# Altium schematic sheet BDC.SchDoc
size C
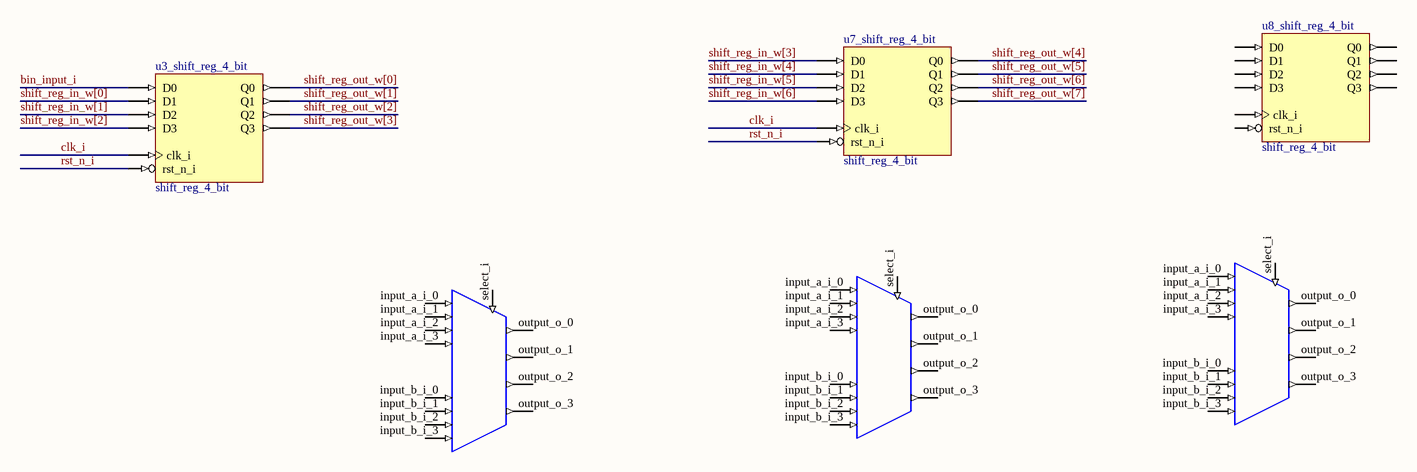
[diagram p0: BDC.SchDoc]

## Parts
(Parts that share a designator on the sheet are numbered #1, #2 ... from top to bottom, then left to right.)
u3_shift_reg_4_bit  shift_reg_4_bit
u7_shift_reg_4_bit  shift_reg_4_bit
u8_shift_reg_4_bit  shift_reg_4_bit
U?#1  mux_2to1_4bit  (value not drawn)
U?#2  mux_2to1_4bit  (value not drawn)
U?#3  mux_2to1_4bit  (value not drawn)

## Nets
bin_input_i: u3_shift_reg_4_bit.D0
clk_i: u3_shift_reg_4_bit.clk_i u7_shift_reg_4_bit.clk_i
rst_n_i: u3_shift_reg_4_bit.D4(rst_n_i) u7_shift_reg_4_bit.D4(rst_n_i)
shift_reg_in_w[0]: u3_shift_reg_4_bit.D1
shift_reg_in_w[1]: u3_shift_reg_4_bit.D2
shift_reg_in_w[2]: u3_shift_reg_4_bit.D3
shift_reg_in_w[3]: u7_shift_reg_4_bit.D0
shift_reg_in_w[4]: u7_shift_reg_4_bit.D1
shift_reg_in_w[5]: u7_shift_reg_4_bit.D2
shift_reg_in_w[6]: u7_shift_reg_4_bit.D3
shift_reg_out_w[0]: u3_shift_reg_4_bit.Q0
shift_reg_out_w[1]: u3_shift_reg_4_bit.Q1
shift_reg_out_w[2]: u3_shift_reg_4_bit.Q2
shift_reg_out_w[3]: u3_shift_reg_4_bit.Q3
shift_reg_out_w[4]: u7_shift_reg_4_bit.Q0
shift_reg_out_w[5]: u7_shift_reg_4_bit.Q1
shift_reg_out_w[6]: u7_shift_reg_4_bit.Q2
shift_reg_out_w[7]: u7_shift_reg_4_bit.Q3

Not connected (* = marked no-connect by the designer): u8_shift_reg_4_bit clk_i D0 D1 D2 D3 D4(rst_n_i) Q0 Q1 Q2 Q3; U?#1 input_a_i_0 input_a_i_1 input_a_i_2 input_a_i_3 input_b_i_0 input_b_i_1 input_b_i_2 input_b_i_3 output_o_0 output_o_1 output_o_2 output_o_3 select_i; U?#2 input_a_i_0 input_a_i_1 input_a_i_2 input_a_i_3 input_b_i_0 input_b_i_1 input_b_i_2 input_b_i_3 output_o_0 output_o_1 output_o_2 output_o_3 select_i; U?#3 input_a_i_0 input_a_i_1 input_a_i_2 input_a_i_3 input_b_i_0 input_b_i_1 input_b_i_2 input_b_i_3 output_o_0 output_o_1 output_o_2 output_o_3 select_i

## Library data of the parts
u3_shift_reg_4_bit u7_shift_reg_4_bit u8_shift_reg_4_bit = FD4RE: 4-Bit Data Registers with Clock Enable and Synchronous Reset; FPGAVendor: CUPL; Published: 17/04/2002 5:24:18 PM; DatasheetDocument: 1999; Publisher: Altium Limited
U?#1-U?#3 = mux_2to1_4bit: 2 to 1 Mux